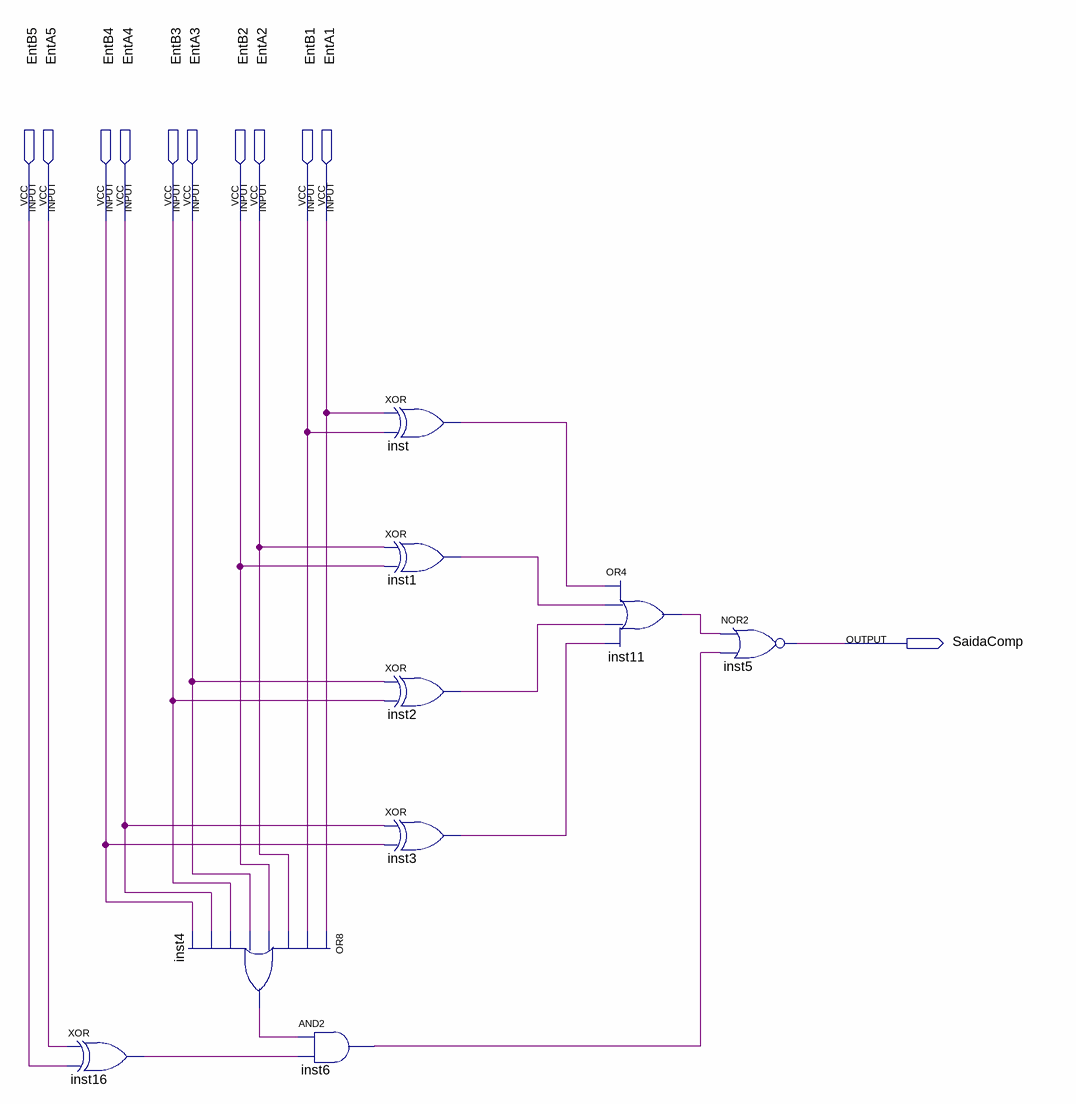
[diagram p0: schematic sheet]
// Quartus schematic AigualB.bdf as structural Verilog: 9 symbols, 11 pins
module AigualB (
  input  EntB5,
  input  EntA5,
  input  EntB4,
  input  EntA4,
  input  EntB3,
  input  EntA3,
  input  EntB2,
  input  EntA2,
  input  EntB1,
  input  EntA1,
  output SaidaComp
);

  wire inst1_out, inst2_out, inst3_out, inst4_out, inst6_out, inst11_out, inst16_out, inst_out;

  xor inst16 (inst16_out, EntA5, EntB5);
  or inst4 (inst4_out, EntA1, EntB1, EntA2, EntB2, EntA3, EntB3, EntA4, EntB4);
  and inst6 (inst6_out, inst4_out, inst16_out);
  xor inst (inst_out, EntA1, EntB1);
  xor inst1 (inst1_out, EntA2, EntB2);
  xor inst2 (inst2_out, EntA3, EntB3);
  xor inst3 (inst3_out, EntA4, EntB4);
  or inst11 (inst11_out, inst_out, inst1_out, inst2_out, inst3_out);
  nor inst5 (SaidaComp, inst11_out, inst6_out);
endmodule
